# Altium schematic sheet Atmega328p_custom_board.SchDoc
size A2
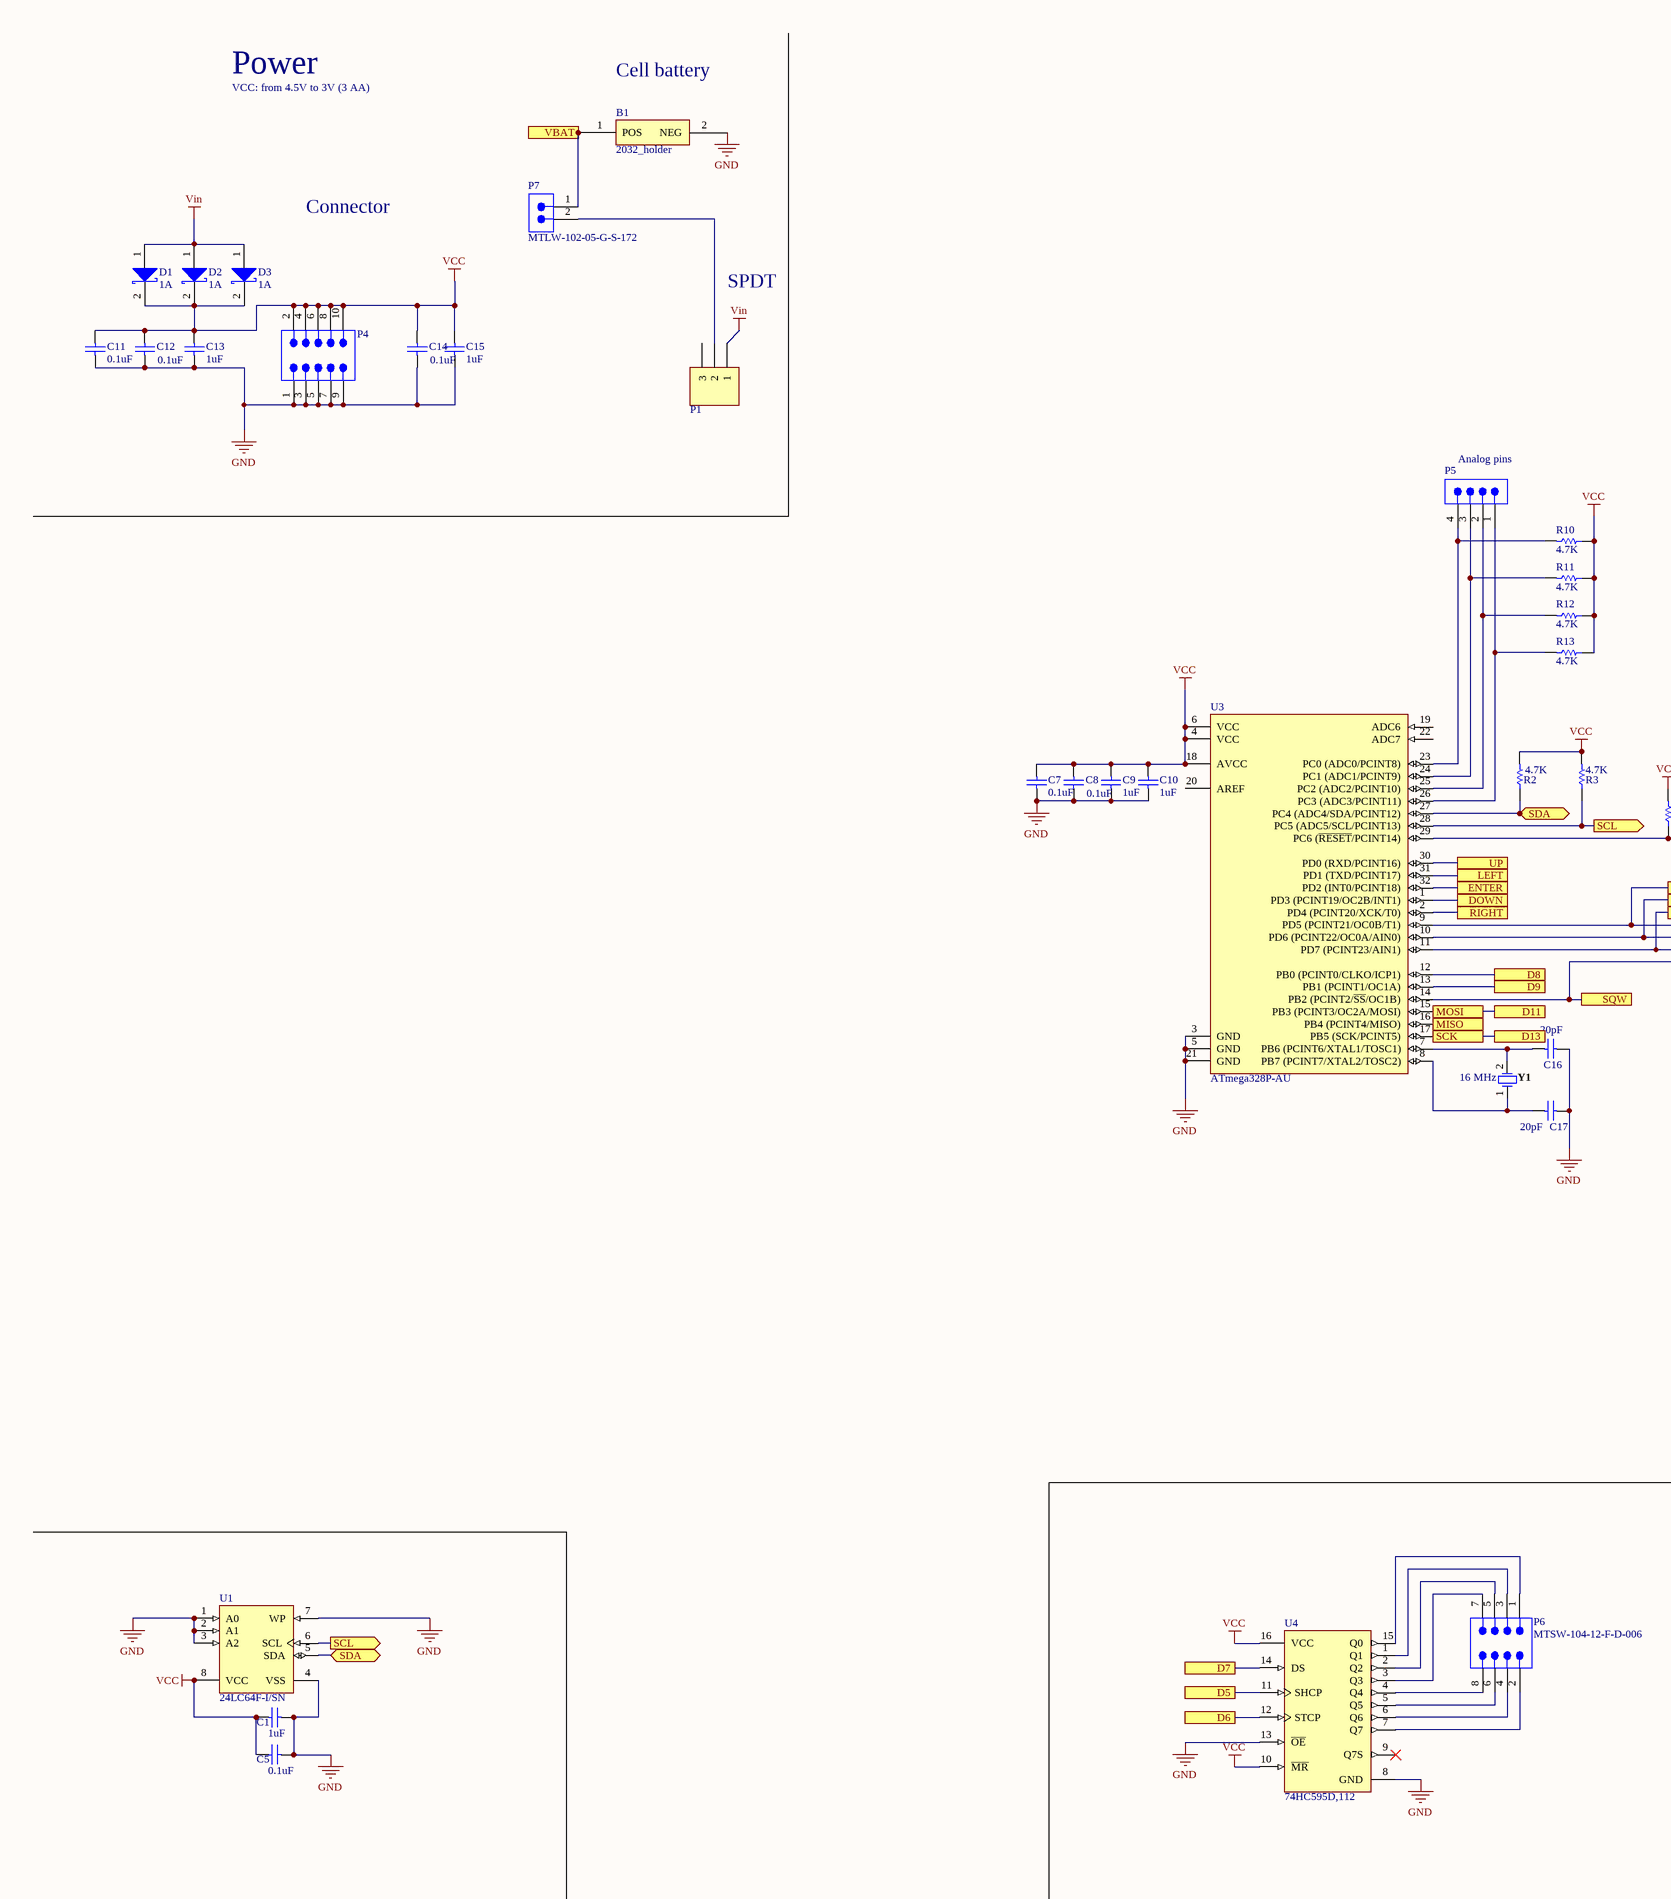
[diagram p0: Atmega328p_custom_board.SchDoc, left]
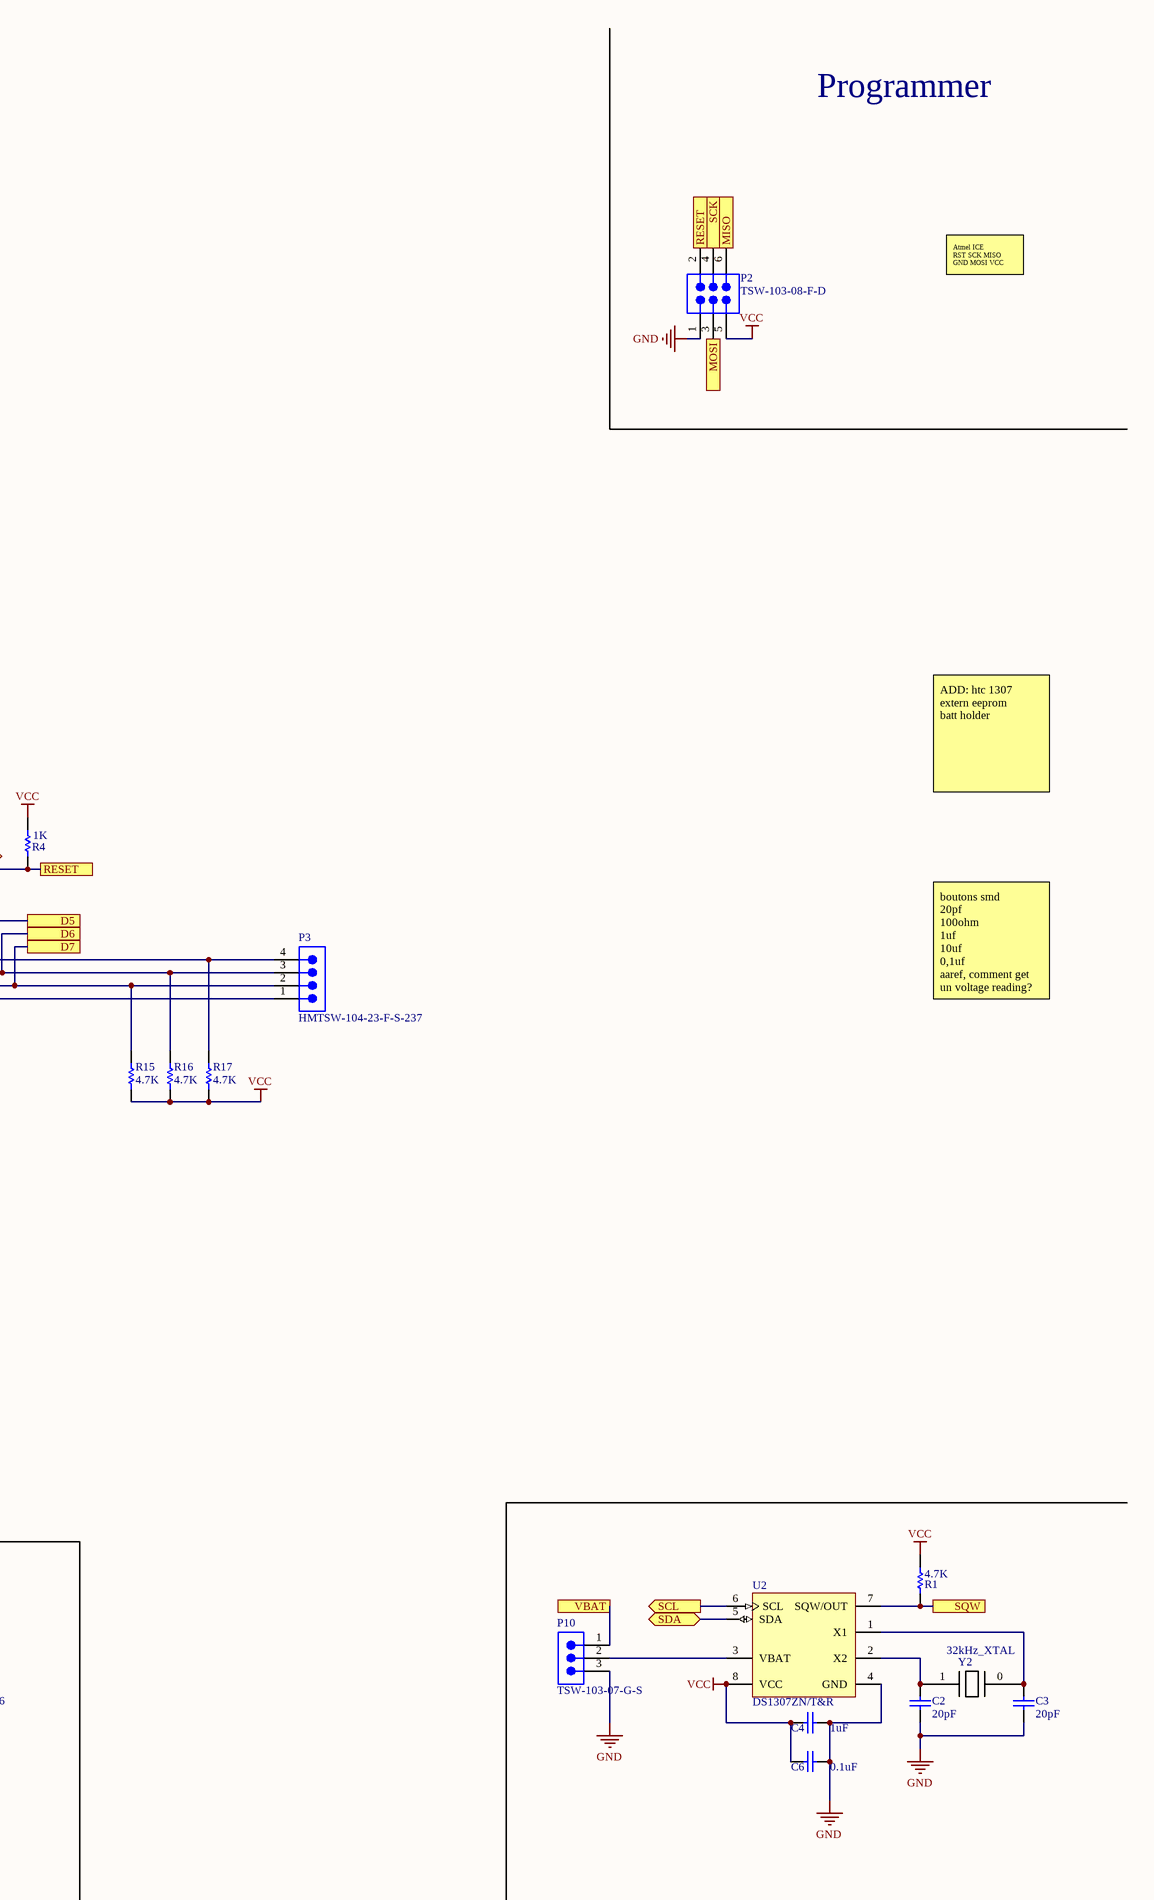
[diagram p1: Atmega328p_custom_board.SchDoc, right]

## Parts
B1  2032_holder  [2032_BATTERY_HOLDER]
C1  1uF  [CAPC0603(1608)100_M]
C2  20pF  [CAPC0603(1608)100_M]
C3  20pF  [CAPC0603(1608)100_M]
C4  1uF  [CAPC0603(1608)100_M]
C5  0.1uF  [CAPC0603(1608)100_M]
C6  0.1uF  [CAPC0603(1608)100_M]
C7  0.1uF  [CAPC0603(1608)100_M]
C8  0.1uF  [CAPC0603(1608)100_M]
C9  1uF  [CAPC0603(1608)100_M]
C10  1uF  [CAPC0603(1608)100_M]
C11  0.1uF  [CAPC0603(1608)100_M]
C12  0.1uF  [CAPC0603(1608)100_M]
C13  1uF  [CAPC0603(1608)100_M]
C14  0.1uF  [CAPC0603(1608)100_M]
C15  1uF  [CAPC0603(1608)100_M]
C16  20pF  [CAPC0603(1608)100_M]
C17  20pF  [CAPC0603(1608)100_M]
D1  1A  [DIOD-SOD-123-2_V]
D2  1A  [DIOD-SOD-123-2_V]
D3  1A  [DIOD-SOD-123-2_V]
P1  Header 3  [HDR1X3]  (value not drawn)
P2  TSW-103-08-F-D  [SMTC-TSW-103-08-X-D]
P3  HMTSW-104-23-F-S-237  [SMTC-HMTSW-104-23-X-S-237]
P4  MTSW-105-07-L-D-230  [SMTC-MTSW-105-07-X-D-230]  (value not drawn)
P5  HMTSW-104-23-F-S-237  [SMTC-HMTSW-104-23-X-S-237]  (value not drawn)
P6  MTSW-104-12-F-D-006  [SMTC-MTSW-104-12-X-D-006]
P7  MTLW-102-05-G-S-172  [SMTC-MTLW-102-05-X-S-172]
P10  TSW-103-07-G-S  [SMTC-TSW-103-07-X-S]
R1  4.7K  [RESC1608X55X25ML10T15]
R2  4.7K  [RESC1608X55X25ML10T15]
R3  4.7K  [RESC1608X55X25ML10T15]
R4  1K  [RESC0603(1608)_M]
R10  4.7K  [RESC1608X55X25ML10T15]
R11  4.7K  [RESC1608X55X25ML10T15]
R12  4.7K  [RESC1608X55X25ML10T15]
R13  4.7K  [RESC1608X55X25ML10T15]
R15  4.7K  [RESC1608X55X25ML10T15]
R16  4.7K  [RESC1608X55X25ML10T15]
R17  4.7K  [RESC1608X55X25ML10T15]
U1  24LC64F-I/SN  [SOIC-SN8_N]
U2  DS1307ZN/T&R  [S8-2_N]
U3  ATmega328P-AU  [32A_M]
U4  74HC595D,112  [FP-SOT109-1-MFG]
Y1  16 MHz  [ADAI-THHF-49S3]
Y2  32kHz_XTAL  [32kHz_XTAL]

## Ports
D5, D6, D7, D8, D9, D11, D13, DOWN, ENTER, LEFT, MISO, MOSI, RESET, RIGHT, SCK, SCL (out), SDA (bidir), SQW, UP, VBAT

## Nets
GND: B1.2(NEG) C1.2 C2.2 C3.2 C4.2 C5.2 C6.2 C7.2 C8.2 C9.2 C10.2 C11.2 C12.2 C13.2 C14.2 C15.2 C16.1 C17.1 P2.1 P4.1 P4.3 P4.5 P4.7 P4.9 P10.3 U1.1(A0) U1.2(A1) U1.3(A2) U1.4(VSS) U1.7(WP) U2.4(GND) U3.3(GND) U3.5(GND) U3.21(GND) U4.8(GND) U4.13(~{OE})
VCC: C1.1 C4.1 C5.1 C6.1 C7.1 C8.1 C9.1 C10.1 C11.1 C12.1 C13.1 C14.1 C15.1 D1.2(K) D2.2(K) D3.2(K) P2.5 P4.2 P4.4 P4.6 P4.8 P4.10 R1.2 R2.2 R3.2 R4.2 R10.1 R11.1 R12.1 R13.1 R15.1 R16.1 R17.1 U1.8(VCC) U2.8(VCC) U3.4(VCC) U3.6(VCC) U3.18(AVCC) U4.10(~{MR}) U4.16(VCC)
Vin: D1.1(A) D2.1(A) D3.1(A) P1.1
D5: P3.4 R17.2 U3.9(PD5_(PCINT21/OC0B/T1)) U4.11(SHCP) ; port D5
D6: P3.3 R16.2 U3.10(PD6_(PCINT22/OC0A/AIN0)) U4.12(STCP) ; port D6
D7: P3.2 R15.2 U3.11(PD7_(PCINT23/AIN1)) U4.14(DS) ; port D7
D8: U3.12(PB0_(PCINT0/CLKO/ICP1)) ; port D8
D9: U3.13(PB1_(PCINT1/OC1A)) ; port D9
D11: P2.3 U3.15(PB3_(PCINT3/OC2A/MOSI)) ; port MOSI, port D11
D13: P2.4 U3.17(PB5_(SCK/PCINT5)) ; port SCK, port D13
DOWN: U3.1(PD3_(PCINT19/OC2B/INT1)) ; port DOWN
ENTER: U3.32(PD2_(INT0/PCINT18)) ; port ENTER
LEFT: U3.31(PD1_(TXD/PCINT17)) ; port LEFT
MISO: P2.6 U3.16(PB4_(PCINT4/MISO)) ; port MISO
RESET: P2.2 R4.1 U3.29(PC6_(~{RESET}/PCINT14)) ; port RESET
RIGHT: U3.2(PD4_(PCINT20/XCK/T0)) ; port RIGHT
SCL: R3.1 U1.6(SCL) U2.6(SCL) U3.28(PC5_(ADC5/SCL/PCINT13)) ; port SCL
SDA: R2.1 U1.5(SDA) U2.5(SDA) U3.27(PC4_(ADC4/SDA/PCINT12)) ; port SDA
SQW: P3.1 R1.1 U2.7(SQW/OUT) U3.14(PB2_(PCINT2/~{SS}/OC1B)) ; port SQW
UP: U3.30(PD0_(RXD/PCINT16)) ; port UP
VBAT: B1.1(POS) P7.1 P10.1 ; port VBAT
NetC2_1: C2.1 U2.2(X2) Y2.1
NetC3_1: C3.1 U2.1(X1) Y2.0
NetC16_2: C16.2 U3.7(PB6_(PCINT6/XTAL1/TOSC1)) Y1.2
NetC17_2: C17.2 U3.8(PB7_(PCINT7/XTAL2/TOSC2)) Y1.1
NetP1_2: P1.2 P7.2
NetP5_1: P5.1 R13.2 U3.26(PC3_(ADC3/PCINT11))
NetP5_2: P5.2 R12.2 U3.25(PC2_(ADC2/PCINT10))
NetP5_3: P5.3 R11.2 U3.24(PC1_(ADC1/PCINT9))
NetP5_4: P5.4 R10.2 U3.23(PC0_(ADC0/PCINT8))
NetP6_1: P6.1 U4.15(Q0)
NetP6_2: P6.2 U4.7(Q7)
NetP6_3: P6.3 U4.1(Q1)
NetP6_4: P6.4 U4.6(Q6)
NetP6_5: P6.5 U4.2(Q2)
NetP6_6: P6.6 U4.5(Q5)
NetP6_7: P6.7 U4.3(Q3)
NetP6_8: P6.8 U4.4(Q4)
NetP10_2: P10.2 U2.3(VBAT)

Not connected (* = marked no-connect by the designer): P1 3; U3 19(ADC6) 20(AREF) 22(ADC7); U4 9(Q7S)*

## Notes on the sheet
- Power
- VCC: from 4.5V to 3V (3 AA)
- Cell battery
- Programmer
- Connector
- SPDT
- Atmel ICE
  RST SCK MISO
  GND MOSI VCC
- (near P5) Analog pins
- ADD: htc 1307
  extern eeprom
  batt holder
- boutons smd
  20pf
  100ohm
  1uf
  10uf
  0,1uf
  aaref, comment get un voltage reading?
  5 boutons, buzzer,
- Title
- Size:
- Date:
- File:
- A2
- Number:
- Time:
- Revision:
- Sheet
- of

## Library data of the parts
C1-C17 = CMP-1035-00774-1: CAP 20pF 25V ±0.25pF 0603 (1608 Metric) Thickness 1mm SMD; Case-EIA: 0603; Tolerance: Â±0.25pF; Case-Metric: 1608; Max Thickness: 1 mm; Rated Voltage: 25 V; Technology: SMT; Value: 20pF
D1-D3 = CMP-0303-00003-1: 1.0 A Surface Mount Schottky Barrier Rectifier, 40 V, -65 to 125 degC, 2-Pin SOD-123 Package, RoHS, Tape and Reel; PartNumber: 1N5819HW-7-F; Manufacturer: Diodes Inc; @ VR (V): 40; @ Terminal Temperature TT (degC): 90; Maximum Average Rectified Current IO (A): 1; Total Capacitance CT (pF): 50; Peak Forward Surge Current IFSM (A): 25; Forward Voltage Drop VF (V): 0.45; VR (RMS) (V): 28; RoHS: TRUE; ComponentLink2URL: http://www.diodes.com/datasheets/ds30217.pdf; PackageDescription: 2-Pin SOD-123, Body 2.7 x 1.55 mm, Pitch 3.7 mm; @ IF (A): 1; Operating and Storage Temperature Range: -65 to 125 degC; ComponentLink1Description: Manufacturer URL; ComponentLink2Description: Datasheet; ComponentLink1URL: http://www.diodes.com/; Mounting Technology: Surface Mount; DatasheetVersion: Rev. 15-2; PackageReference: SOD-123-2; Maximum Reverse Current IR (uA): 50; Peak Repetitive Reverse Voltage VRRM (V): 40; Packing: Tape and Reel
P1 = Header 3: Header, 3-Pin; LatestRevisionDate: 17-Jul-2002; LatestRevisionNote: Re-released for DXP Platform.; Publisher: Altium Limited
P2 = CMP-1024-00337-1: 0.025" SQ Post Header, Through-hole, Vertical, -55 to 125 degC, 2.54 mm Pitch, 6-Pin, Male, RoHS; Manufacturer: Samtec; Pitch: 2.54 mm; ComponentLink1URL: http://www.samtec.com; PackageReference: TSW-103-08-X-D; ComponentLink3Description: Package Specification; PackageDescription: .025[0.64] SQ. Post Terminal Strip Assembly; PartNumber: TSW-103-08-F-D; DatasheetVersion: F-214; ComponentLink1Description: Manufacturer URL; ComponentLink2Description: Datasheet; ComponentLink2URL: http://www.samtec.com/documents/webfiles/pdf/TSW_TH.PDF; PackageVersion: DM, 8/1988; Orientation: Vertical; Mounting Technology: Through-hole; RoHS: True; Temperature Range: -55 to 125 degC; ComponentLink3URL: http://www.samtec.com/documents/webfiles/cpdf/TSW-XXX-XX-XXX-X-XX-XXX-MKT.pdf
P3 P5 = CMP-1024-00021-1: Modified .025" SQ Post Header, Through-hole, Vertical, -55 to 125 degC, 2.54 mm Pitch, 4-Pin, Male, RoHS; Manufacturer: Samtec; Pitch: 2.54 mm; PackageReference: HMTSW-104-23-X-S-237; ComponentLink2URL: http://www.samtec.com/documents/webfiles/pdf/HMTSW.PDF; ComponentLink3Description: Package Specification; PartNumber: HMTSW-104-23-F-S-237; RoHS: True; ComponentLink2Description: Datasheet; Temperature Range: -55 to 125 degC; ComponentLink1Description: Manufacturer URL; DatasheetVersion: F-214; PackageDescription: Assembly .025 [.64] SQ. Post Hi-Temp Terminal Strip; Orientation: Vertical; PackageVersion: AL, 3/1987; Mounting Technology: Through-hole; ComponentLink1URL: http://www.samtec.com; ComponentLink3URL: http://www.samtec.com/documents/webfiles/cpdf/HMTSW-XXX-XX-X-X-XXXX-XX-XX-MKT1.pdf
P4 = CMP-1024-00115-1: Modified .025" SQ Post Header, Through-hole, Vertical, -55 to 125 degC, 2.54 mm Pitch, 10-Pin, Male, RoHS; Manufacturer: Samtec; Pitch: 2.54 mm; PackageReference: MTSW-105-07-X-D-230; ComponentLink3Description: Package Specification; PartNumber: MTSW-105-07-L-D-230; DatasheetVersion: F-214; RoHS: True; Orientation: Vertical; Temperature Range: -55 to 125 degC; PackageVersion: BI, 2/1987; ComponentLink2Description: Datasheet; ComponentLink3URL: http://www.samtec.com/documents/webfiles/cpdf/MTSW-XXX-XX-X-X-XXXX-XX-XXX-MKT1.pdf; PackageDescription: Assembly .025" [.64] SQ Post Terminal Strip; ComponentLink1Description: Manufacturer URL; ComponentLink2URL: http://www.samtec.com/documents/webfiles/pdf/MTSW.PDF; Mounting Technology: Through-hole; ComponentLink1URL: http://www.samtec.com
P6 = CMP-1024-00109-1: Modified .025" SQ Post Header, Through-hole, Vertical, -55 to 125 degC, 2.54 mm Pitch, 8-Pin, Male, RoHS; Manufacturer: Samtec; Pitch: 2.54 mm; Orientation: Vertical; Mounting Technology: Through-hole; ComponentLink2Description: Datasheet; PartNumber: MTSW-104-12-F-D-006; ComponentLink2URL: http://www.samtec.com/documents/webfiles/pdf/MTSW.PDF; ComponentLink1Description: Manufacturer URL; PackageDescription: Assembly .025" [.64] SQ Post Terminal Strip; Temperature Range: -55 to 125 degC; ComponentLink3Description: Package Specification; ComponentLink1URL: http://www.samtec.com; PackageReference: MTSW-104-12-X-D-006; RoHS: True; ComponentLink3URL: http://www.samtec.com/documents/webfiles/cpdf/MTSW-XXX-XX-X-X-XXXX-XX-XXX-MKT1.pdf; DatasheetVersion: F-214; PackageVersion: BI, 2/1987
P7 = CMP-1024-00064-1: Low Profile .025" SQ Post Header, Through-hole, Vertical, -55 to 125 degC, 2.54 mm Pitch, 2-Pin, Male, RoHS; Manufacturer: Samtec; Pitch: 2.54 mm; ComponentLink2URL: http://www.samtec.com/documents/webfiles/pdf/MTLW_TH.PDF; PackageDescription: Low Profile Terminal Assembly; ComponentLink3URL: http://www.samtec.com/documents/webfiles/cpdf/MTLW-1XX-XX-XX-X-XXX-XX-XX-MKT1.pdf; PackageReference: MTLW-102-05-X-S-172; Mounting Technology: Through-hole; ComponentLink2Description: Datasheet; PackageVersion: T, 6/1991; Orientation: Vertical; DatasheetVersion: F-214; RoHS: True; ComponentLink3Description: Package Specification; ComponentLink1URL: http://www.samtec.com; Temperature Range: -55 to 125 degC; PartNumber: MTLW-102-05-G-S-172; ComponentLink1Description: Manufacturer URL
P10 = CMP-1024-00333-1: 0.025" SQ Post Header, Through-hole, Vertical, -55 to 125 degC, 2.54 mm Pitch, 3-Pin, Male, RoHS; Manufacturer: Samtec; Pitch: 2.54 mm; ComponentLink3URL: http://www.samtec.com/documents/webfiles/cpdf/TSW-XXX-XX-XXX-X-XX-XXX-MKT.pdf; Temperature Range: -55 to 125 degC; DatasheetVersion: F-214; ComponentLink1Description: Manufacturer URL; ComponentLink2URL: http://www.samtec.com/documents/webfiles/pdf/TSW_TH.PDF; RoHS: True; Orientation: Vertical; ComponentLink2Description: Datasheet; ComponentLink3Description: Package Specification; PackageDescription: .025[0.64] SQ. Post Terminal Strip Assembly; Mounting Technology: Through-hole; PackageVersion: DM, 8/1988; ComponentLink1URL: http://www.samtec.com; PackageReference: TSW-103-07-X-S; PartNumber: TSW-103-07-G-S
R1-R3 R10-R13 R15-R17 = CMP-2000-05024-1: Chip Resistor, 4.7 KOhm, +/- 5%, 100 mW, -55 to 155 degC, 0603 (1608 Metric), RoHS, Tape and Reel; Manufacturer: Yageo; Resistance: 4.7kOhms; Temperature Coefficient: 100PPM/C; Power Rating: 100mW; Voltage Rating: 50V; Operating Temperature Range: -55Cto+155C; Case Code - mm: 1608; Tolerance: 5%; Product: ThickFilmResistorsGeneralPurpose; Case Code - in: 0603; Datasheet URL: http://www.yageo.com/documents/recent/PYu-RC_Group_51_RoHS_L_04.pdf; Package Reference: 603; Datasheet Version: Rev. 4, 02/2016; Package Description: 2-Pin Surface Mount Device, Body 1.6 x 0.8 mm; Manufacturer URL: http://www.yageo.com/; Series: RC; Packaging: Reel; Termination Style: SMD/SMT
R4 = CMP-1012-00510-1: 1K 0.1W 1% 0603 (1608 Metric)  SMD; Case-Metric: 1608; Case-EIA: 0603; Value: 1000.00 Ohm; Technology: SMT; Tolerance: 1 %; Power: 0.1 W
U1 = CMP-0159-00258-1: 64Kbit, 400kHz, 2.5V, I2C Serial EEPROM, 8-Pin SOIC 150mil, Industrial Temperature; PackageReference: SOIC-SN8; PackageDescription: 8-Lead Plastic Small Outline (SN) - Narrow, 3.90mm Body [SOIC]; DatasheetVersion: revA, May-2009; PackageVersion: revBB, Aug-2009; Code_JEDEC: MS-012; Code_IPC: SOIC127P600-8
U2 = CMP-0254-00304-1: 64 x 8, Serial, I2C Real-Time Clock, 5.0V, 8-Pin SO, -40 to 85 degC, Reel; PackageReference: S8-2; PackageDescription: 8-Pin Small-Outline IC, Narrow (0.15in), 1.27 mm Pitch, SOIC (N); Code_JEDEC: MS-012-AA; ComponentLink3URL: http://pdfserv.maxim-ic.com/package_dwgs/21-0041.PDF; DatasheetVersion: 10-Feb-2008; PackageVersion: revC, 2010; ComponentLink2Description: Datasheet; Code_IPC: SOIC127P600-8; ComponentLink1Description: Manufacturer URL; ComponentLink1URL: http://www.maxim-ic.com; ComponentLink3Description: Package Specification; ComponentLink2URL: http://datasheets.maxim-ic.com/en/ds/DS1307.pdf
U3 = CMP-0095-00269-1: 8-bit AVR Microcontroller, 32KB Flash, 1KB EEPROM, 2KB SRAM, 32-pin TQFP, Industrial Grade (-40°C to 85°C); Code_JEDEC: MS-026-ABA; PackageVersion: revB, Oct-2001; DatasheetVersion: revA, Jan-2010; PackageReference: 32A; PackageDescription: 32-Lead, 7x7x1.0 mm Body, 0.8mm Lead Pitch, Thin Profile Plastic Quad Flat Package (TQFP)
U4 = CMP-14351-000003-1: IC SHIFT REGISTER 8BIT 16SOIC; Manufacturer: Nexperia; Propagation Delay: 16ns; Number Of Circuits: 1; Min Supply Voltage: 2V; Nominal Supply Current: 70mA; Standoff Height: 0.1mm; Frequency: 108MHz; Max Supply Voltage: 6V; Number Of Outputs: 8; Ambient Temperature Range Low: -40°C; ComponentLink2Description: Datasheet; Temperature Range High: +125°C; Temperature Range Low: -40°C; Octopart: https://octopart.com/74hc595d%2C112-nexperia-78737374; Category: IC; Automotive: No; Digikey Description: IC SHIFT REGISTER 8BIT 16SOIC; Footprint Url: https://assets.nexperia.com/documents/outline-drawing/SOT109-1.pdf; Device Class L3: Shift Registers; Package: SOT109-1; Device Class L2: Logic ICs; Lead Free: Yes; Device Class L1: Integrated Circuits (ICs); Manufacturer Part Number: 74HC595D,112; ComponentLink2URL: https://assets.nexperia.com/documents/data-sheet/74HC_HCT595.pdf; Height: 1.75mm; Ambient Temperature Range High: +125°C; RoHS: TRUE; Number Of Inputs: 1; Temperature: -40°C to +125°C; Mouser Description: 74HC(T)595 - 8-bit serial-in, serial or parallel-out shift register with output latches; 3-state
Y1 = CMP-1740-00002-1: Crystal, 16 MHz, 18 pF, 30 ppm, -20 to 70 degC, 2-Pin THD, RoHS; Lens Style: Dome; Forward Current: 30 mA; Viewing Angle: 60 degrees; Nominal Vf: 2.1 V; Forward Voltage: 2.6 V; Case\Package: Radial; Luminous Intensity: 12.6 mcd; Illumination Colour: Green; Height: 5.2 mm; PackageDescription: 2-Pin Through Hole Device, Body 11.05 x 4.65 mm, Pitch 4.88 mm; Min Operating Temperature: -55 degC; Pins: 2; Radiation Hardening: No; RoHSCompliant: true; Colour: Green; PackageReference: THHF-49S3; DatasheetVersion: Nov-14; ComponentLink2Description: Datasheet; Max Operating Temperature: 100 degC; Mount: Through Hole; Package Quantity: 1000; Packaging: Bulk; ComponentLink1URL: https://www.adafruit.com/; ComponentLink1Description: Manufacturer URL; Length: 3.8 mm; ComponentLink2URL: https://cdn-shop.adafruit.com/product-files/2215/2215datasheet.pdf
B1 = 2032_holder: datasheet: http://www.memoryprotectiondevices.com/datasheets/BS-7-BLUE-datasheet.pdf